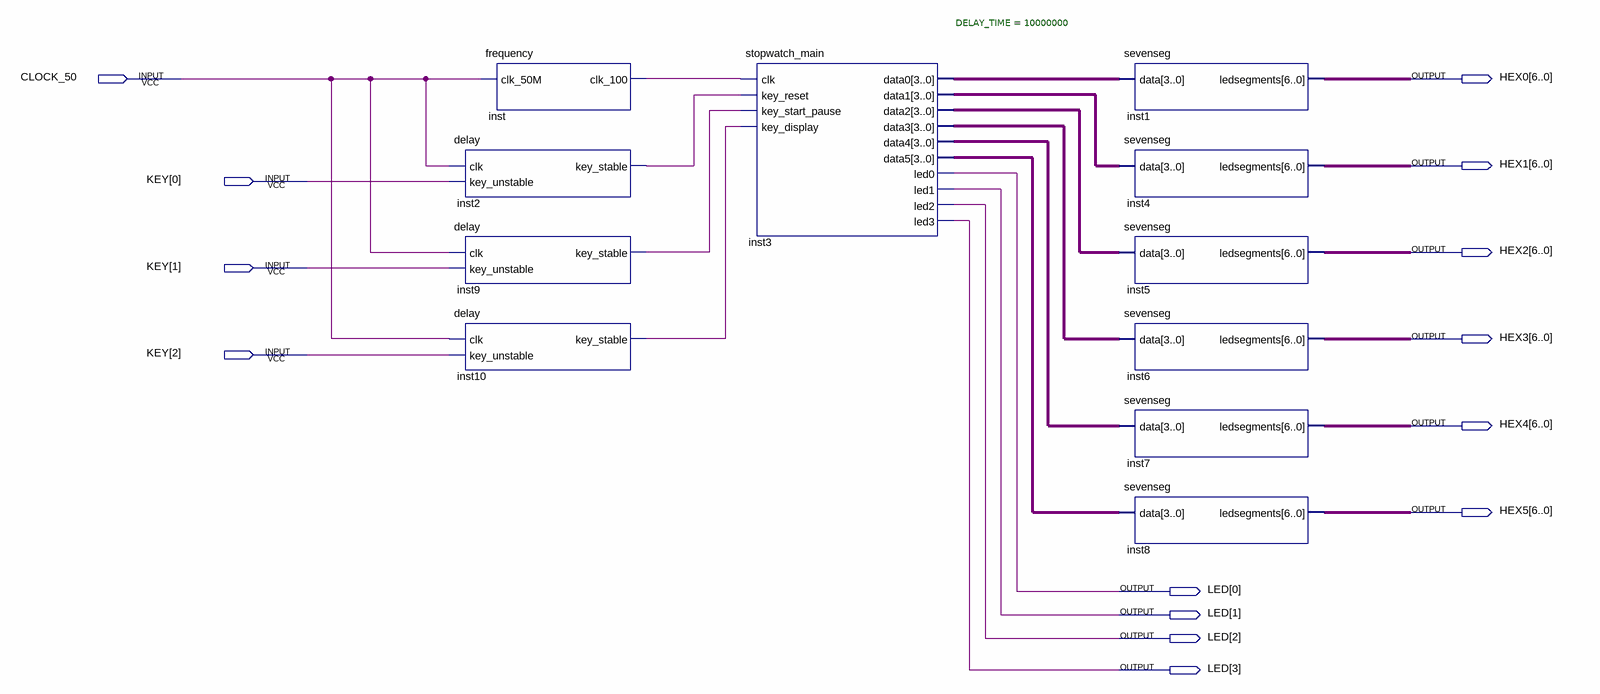
[diagram p0: schematic sheet]
// Quartus schematic FunctionalStopWatch.bdf as structural Verilog: 11 symbols, 14 pins
module FunctionalStopWatch (
  input  CLOCK_50,
  input  [2:0] KEY,
  output [6:0] HEX0,
  output [6:0] HEX1,
  output [6:0] HEX2,
  output [6:0] HEX3,
  output [6:0] HEX4,
  output [6:0] HEX5,
  output [3:0] LED
);

  wire inst2_key_stable, inst9_key_stable, inst10_key_stable, inst_clk_100;
  wire [3:0] inst3_data0, inst3_data1, inst3_data2, inst3_data3, inst3_data4, inst3_data5;

  frequency inst (.clk_50M(CLOCK_50), .clk_100(inst_clk_100));
  delay inst2 (.clk(CLOCK_50), .key_unstable(KEY[0]), .key_stable(inst2_key_stable));
  delay inst9 (.clk(CLOCK_50), .key_unstable(KEY[1]), .key_stable(inst9_key_stable));
  delay inst10 (.clk(CLOCK_50), .key_unstable(KEY[2]), .key_stable(inst10_key_stable));
  stopwatch_main #(.DELAY_TIME(10000000)) inst3 (
    .clk(inst_clk_100), .key_reset(inst2_key_stable), .key_start_pause(inst9_key_stable),
    .key_display(inst10_key_stable), .data0(inst3_data0), .data1(inst3_data1), .data2(inst3_data2),
    .data3(inst3_data3), .data4(inst3_data4), .data5(inst3_data5), .led0(LED[0]), .led1(LED[1]),
    .led2(LED[2]), .led3(LED[3]));
  sevenseg inst1 (.data(inst3_data0), .ledsegments(HEX0));
  sevenseg inst4 (.data(inst3_data1), .ledsegments(HEX1));
  sevenseg inst5 (.data(inst3_data2), .ledsegments(HEX2));
  sevenseg inst6 (.data(inst3_data3), .ledsegments(HEX3));
  sevenseg inst7 (.data(inst3_data4), .ledsegments(HEX4));
  sevenseg inst8 (.data(inst3_data5), .ledsegments(HEX5));
endmodule
